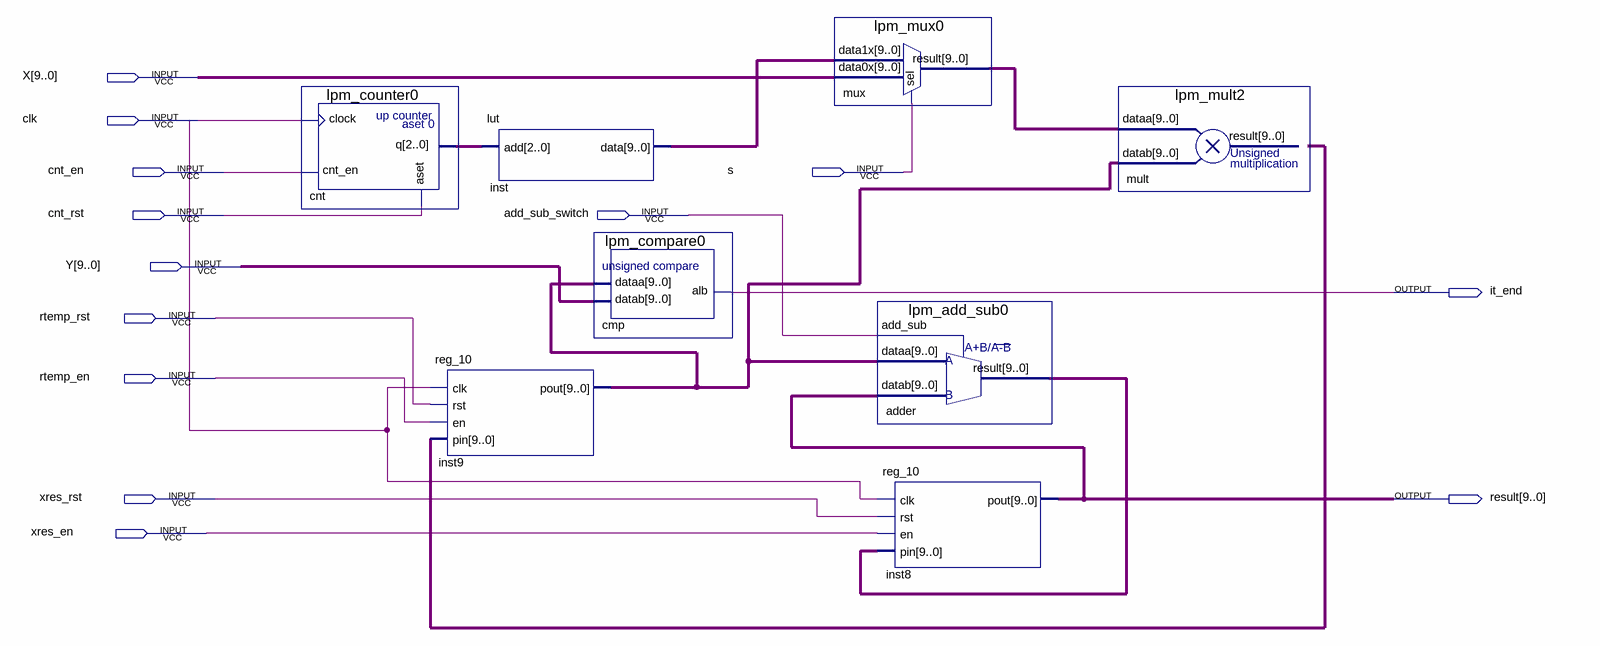
[diagram p0: schematic sheet]
// Quartus schematic cosinus.bdf as structural Verilog: 8 symbols, 13 pins
module cosinus (
  input  [9:0] X,
  input  clk,
  input  cnt_en,
  input  s,
  input  cnt_rst,
  input  add_sub_switch,
  input  [9:0] Y,
  input  rtemp_rst,
  input  rtemp_en,
  input  xres_rst,
  input  xres_en,
  output it_end,
  output [9:0] result
);

  wire [2:0] cnt_q;
  wire [9:0] adder_result, inst9_pout, inst_data, mult_result, mux_result;

  lpm_counter0 cnt (.clock(clk), .cnt_en(cnt_en), .aset(cnt_rst), .q(cnt_q));
  lut inst (.add(cnt_q), .data(inst_data));
  reg_10 inst9 (.clk(clk), .rst(rtemp_rst), .en(rtemp_en), .pin(mult_result), .pout(inst9_pout));
  lpm_compare0 cmp (.dataa(inst9_pout), .datab(Y), .alb(it_end));
  lpm_mux0 mux (.data1x(inst_data), .data0x(X), .sel(s), .result(mux_result));
  lpm_add_sub0 adder (.add_sub(add_sub_switch), .dataa(inst9_pout), .datab(result), .result(adder_result));
  reg_10 inst8 (.clk(clk), .rst(xres_rst), .en(xres_en), .pin(adder_result), .pout(result));
  lpm_mult2 mult (.dataa(mux_result), .datab(inst9_pout), .result(mult_result));
endmodule
